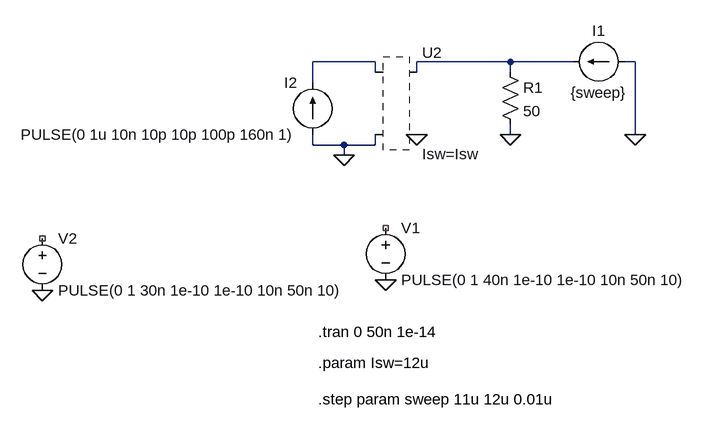
[diagram p0: schematic test1.asc]
test1.asc, the LTspice schematic file:
Version 4
SHEET 1 880 680
WIRE 176 48 80 48
WIRE 384 48 240 48
WIRE 480 48 384 48
WIRE 576 48 560 48
WIRE 176 64 176 48
WIRE 240 64 240 48
WIRE 384 64 384 48
WIRE 80 80 80 48
WIRE 384 160 384 144
WIRE 576 160 576 48
WIRE 80 176 80 160
WIRE 128 176 80 176
WIRE 176 176 176 160
WIRE 176 176 128 176
WIRE 128 192 128 176
FLAG 576 160 0
FLAG 384 160 0
FLAG 240 160 0
FLAG 128 192 0
FLAG 192 384 0
FLAG -336 400 0
SYMBOL current 560 48 R90
WINDOW 0 -32 40 VBottom 2
WINDOW 3 32 40 VTop 2
SYMATTR InstName I1
SYMATTR Value {sweep}
SYMBOL Res 368 48 R0
SYMATTR InstName R1
SYMATTR Value 50
SYMBOL current 80 160 R180
WINDOW 0 24 80 Left 2
WINDOW 3 24 0 Left 2
SYMATTR InstName I2
SYMATTR Value PULSE(0 1u 10n 10p 10p 100p 160n 1)
SYMBOL snspdWithPhotonPort 240 112 R0
SYMATTR InstName U2
SYMATTR Value Isw=Isw
SYMBOL Voltage 192 288 R0
SYMATTR InstName V1
SYMATTR Value PULSE(0 1 40n 1e-10 1e-10 10n 50n 10)
SYMBOL Voltage -336 304 R0
SYMATTR InstName V2
SYMATTR Value PULSE(0 1 30n 1e-10 1e-10 10n 50n 10)
TEXT 88 464 Left 2 !.tran 0 50n 1e-14
TEXT 88 512 Left 2 !.param Isw=12u
TEXT 88 568 Left 2 !.step param sweep 11u 12u 0.01u

The netlist it stands for:
* test1.asc
I1 0 N002 {sweep}
R1 N002 0 50
I2 0 N001 PULSE(0 1u 10n 10p 10p 100p 160n 1)
* U2: Isw=Isw (symbol snspdWithPhotonPort not available, pin order unknown); nets seen at it: 0, N001, N002
V1 NC_01 0 PULSE(0 1 40n 1e-10 1e-10 10n 50n 10)
V2 NC_02 0 PULSE(0 1 30n 1e-10 1e-10 10n 50n 10)
.tran 0 50n 1e-14
.param Isw=12u
.step param sweep 11u 12u 0.01u
.backanno
.end